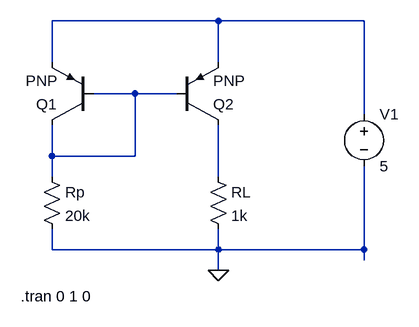
[diagram p0: schematic Current-Mirror.asc]
Current-Mirror.asc, the LTspice schematic file:
Version 4
SHEET 1 880 680
WIRE -480 0 -736 0
WIRE -256 0 -480 0
WIRE -736 64 -736 0
WIRE -480 64 -480 0
WIRE -608 112 -672 112
WIRE -544 112 -608 112
WIRE -256 144 -256 0
WIRE -736 208 -736 160
WIRE -608 208 -608 112
WIRE -608 208 -736 208
WIRE -736 240 -736 208
WIRE -480 240 -480 160
WIRE -736 352 -736 320
WIRE -480 352 -480 320
WIRE -480 352 -736 352
WIRE -256 352 -256 224
WIRE -256 352 -480 352
WIRE -256 368 -256 352
WIRE -480 384 -480 352
FLAG -480 384 0
SYMBOL voltage -256 128 R0
WINDOW 123 0 0 Left 0
WINDOW 39 0 0 Left 0
SYMATTR InstName V1
SYMATTR Value 5
SYMBOL pnp -672 160 R180
SYMATTR InstName Q1
SYMBOL pnp -544 160 M180
SYMATTR InstName Q2
SYMBOL res -752 224 R0
SYMATTR InstName Rp
SYMATTR Value 20k
SYMBOL res -496 224 R0
SYMATTR InstName RL
SYMATTR Value 1k
TEXT -784 424 Left 2 !.tran 0 1 0

The netlist it stands for:
* Current-Mirror.asc
V1 N001 0 5
Q1 N002 N002 N001 0 PNP
Q2 N003 N002 N001 0 PNP
Rp N002 0 20k
RL N003 0 1k
.model NPN NPN
.model PNP PNP
.lib standard.bjt
.tran 0 1 0
.backanno
.end